# Altium schematic sheet 004-H-01.SchDoc
size A3
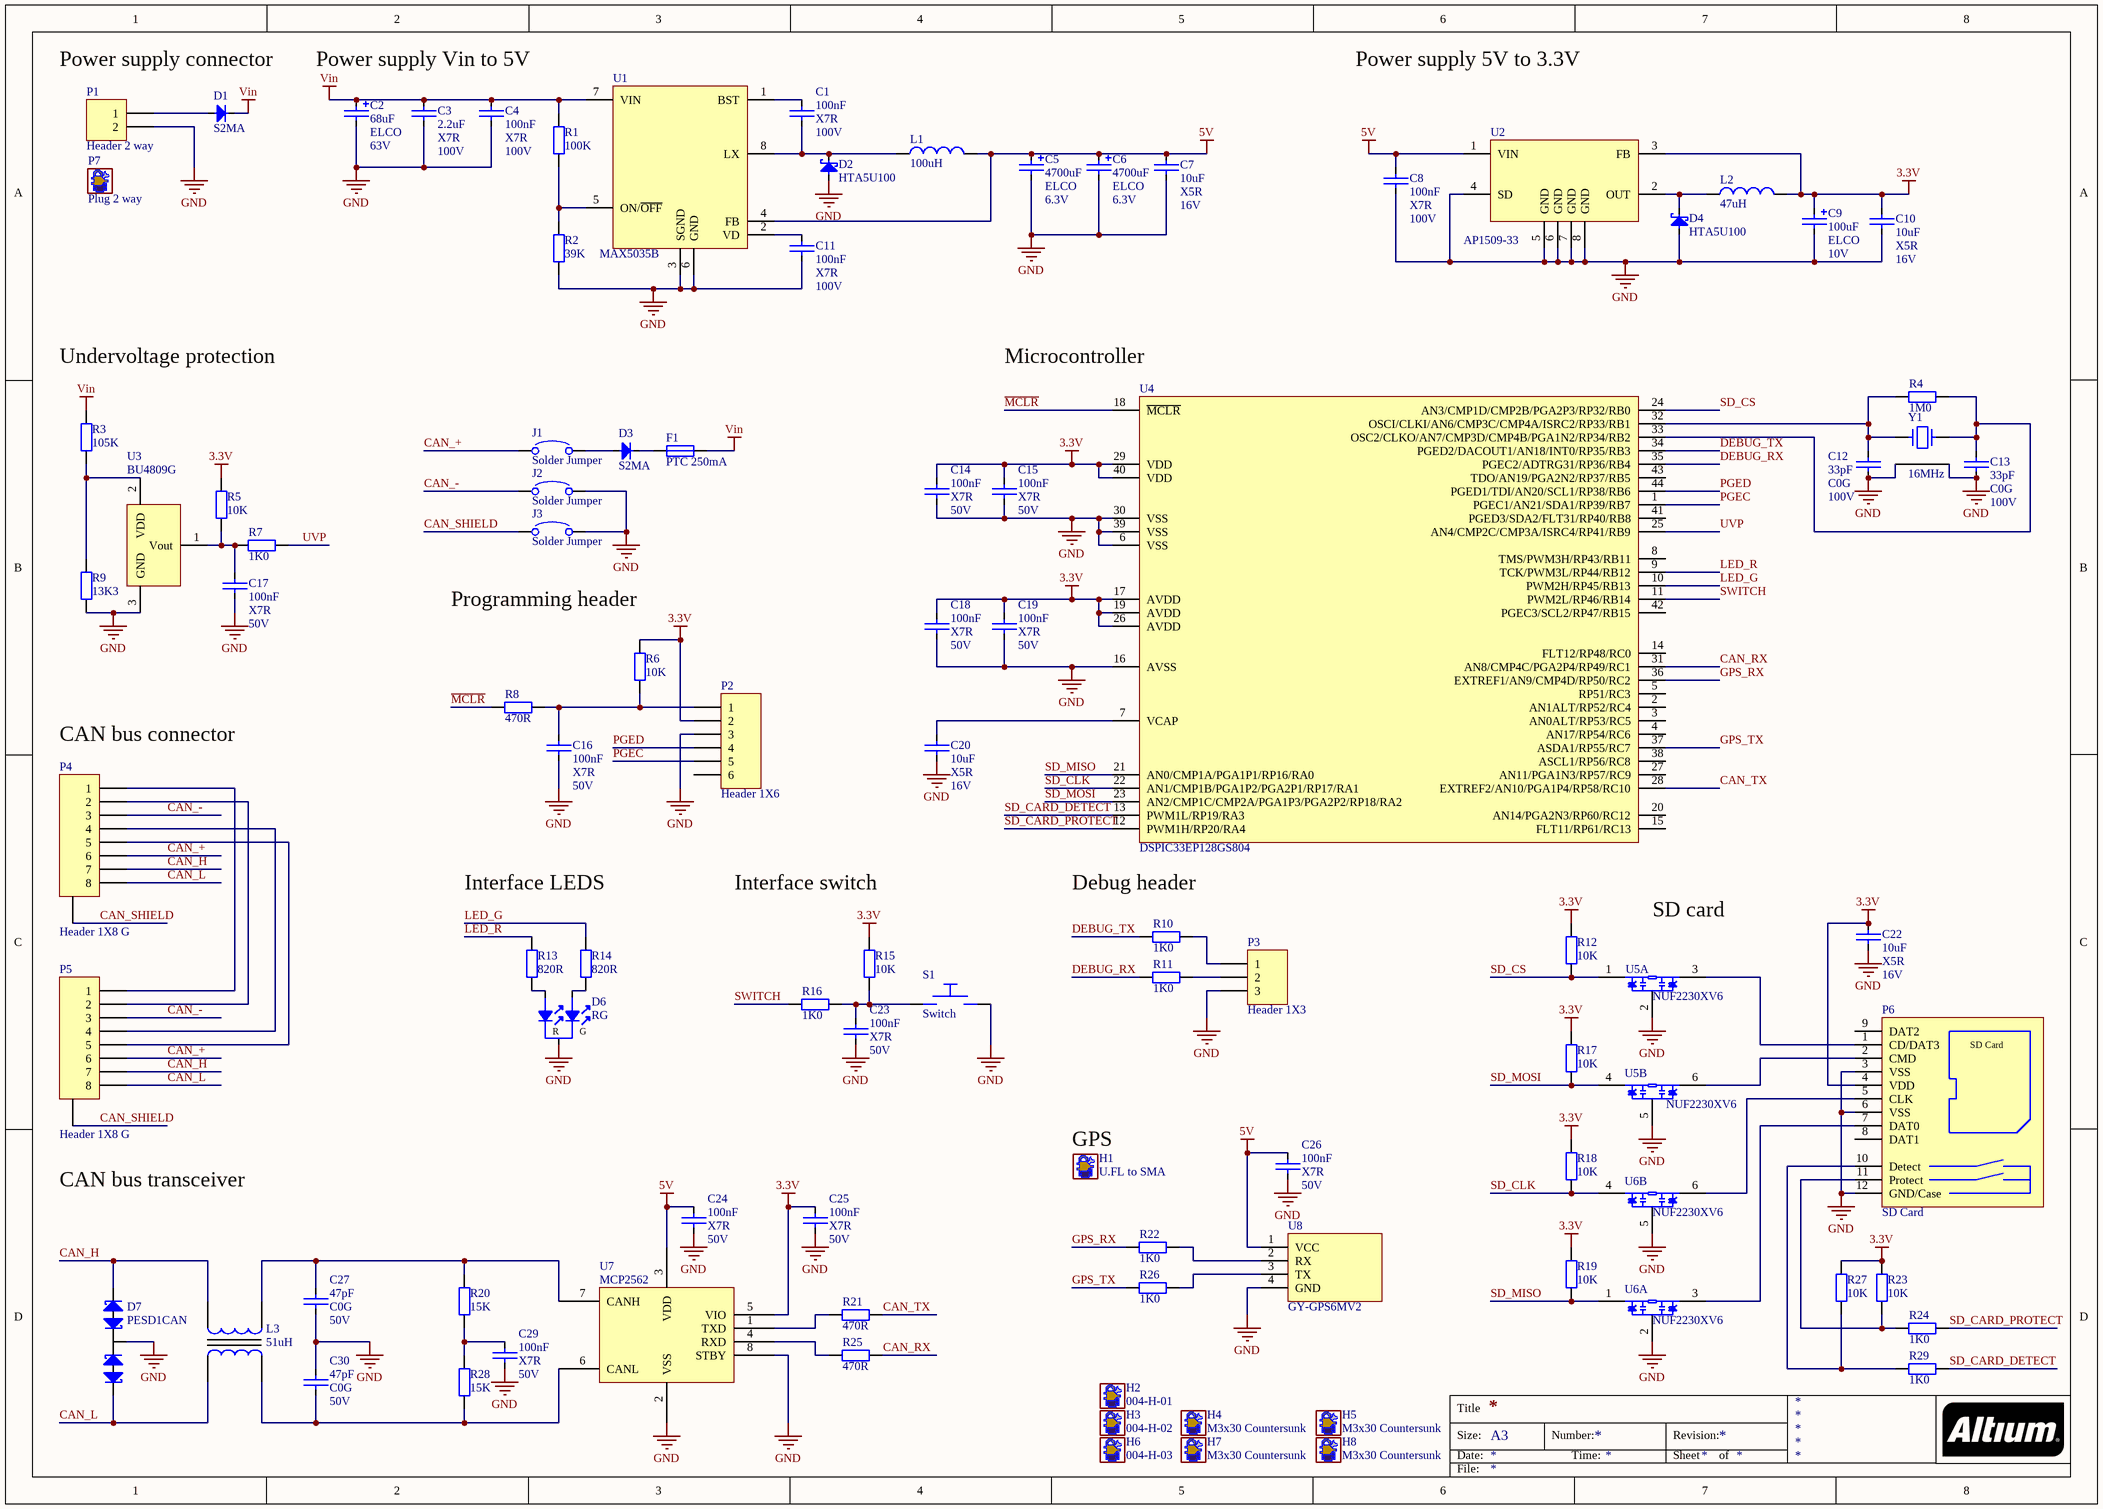
[diagram p0: 004-H-01.SchDoc]

## Parts
C1  100nF  Dielectric: X7R  VoltageRating: 100V  [CAP0805]
C2  68uF  Dielectric: ELCO  VoltageRating: 63V  [CAPP8383X62N]
C3  2.2uF  Dielectric: X7R  VoltageRating: 100V  [CAP1210]
C4  100nF  Dielectric: X7R  VoltageRating: 100V  [CAP0805]
C5  4700uF  Dielectric: ELCO  VoltageRating: 6.3V  [CAPPOL_leaded_D12_5L20P5]
C6  4700uF  Dielectric: ELCO  VoltageRating: 6.3V  [CAPPOL_leaded_D12_5L20P5]
C7  10uF  Dielectric: X5R  VoltageRating: 16V  [CAP1210]
C8  100nF  Dielectric: X7R  VoltageRating: 100V  [CAP0805]
C9  100uF  Dielectric: ELCO  VoltageRating: 10V  [CAPP8383X62N]
C10  10uF  Dielectric: X5R  VoltageRating: 16V  [CAP1210]
C11  100nF  Dielectric: X7R  VoltageRating: 100V  [CAP0805]
C12  33pF  Dielectric: C0G  VoltageRating: 100V  [CAP0603]
C13  33pF  Dielectric: C0G  VoltageRating: 100V  [CAP0603]
C14  100nF  Dielectric: X7R  VoltageRating: 50V  [CAP0603]
C15  100nF  Dielectric: X7R  VoltageRating: 50V  [CAP0603]
C16  100nF  Dielectric: X7R  VoltageRating: 50V  [CAP0603]
C17  100nF  Dielectric: X7R  VoltageRating: 50V  [CAP0603]
C18  100nF  Dielectric: X7R  VoltageRating: 50V  [CAP0603]
C19  100nF  Dielectric: X7R  VoltageRating: 50V  [CAP0603]
C20  10uF  Dielectric: X5R  VoltageRating: 16V  [CAP1210]
C22  10uF  Dielectric: X5R  VoltageRating: 16V  [CAP1210]
C23  100nF  Dielectric: X7R  VoltageRating: 50V  [CAP0603]
C24  100nF  Dielectric: X7R  VoltageRating: 50V  [CAP0603]
C25  100nF  Dielectric: X7R  VoltageRating: 50V  [CAP0603]
C26  100nF  Dielectric: X7R  VoltageRating: 50V  [CAP0603]
C27  47pF  Dielectric: C0G  VoltageRating: 50V  [CAP0603]
C29  100nF  Dielectric: X7R  VoltageRating: 50V  [CAP0603]
C30  47pF  Dielectric: C0G  VoltageRating: 50V  [CAP0603]
D1  S2MA  [DIODEDO-214AC]
D2  HTA5U100  [DIODEDO-214AC]
D3  S2MA  [DIODEDO-214AC]
D4  HTA5U100  [DIODEDO-214AC]
D6  RG  [LED_RG_COMMON_GND]
D7  PESD1CAN  [SOT23-3N]
F1  PTC 250mA  [Fuse1210]
H1  U.FL to SMA
H2  004-H-01
H3  004-H-02
H4  M3x30 Countersunk
H5  M3x30 Countersunk
H6  004-H-03
H7  M3x30 Countersunk
H8  M3x30 Countersunk
J1  Solder Jumper  [SolderJumer]  (no BOM)
J2  Solder Jumper  [SolderJumer]  (no BOM)
J3  Solder Jumper  [SolderJumer]  (no BOM)
L1  100uH  [INDP3030X28N]
L2  47uH  [INDP3030X28N]
L3  51uH  [IND200P450X300-4N]
P1  Header 2 way  [21.95MH/2-E]
P2  Header 1X6  [Header1X6P100]
P3  Header 1X3  [Header1X3P100]
P4  Header 1X8 G  [TECO-1-406541-5]
P5  Header 1X8 G  [TECO-1-406541-5]
P6  SD Card  [SDK-9BNS-K13-GS-TB]
P7  Plug 2 way
R1  100K  [RES0805]
R2  39K  [RES0805]
R3  105K  [RES0805]
R4  1M0  [RES0603]
R5  10K  [RES0603]
R6  10K  [RES0603]
R7  1K0  [RES0603]
R8  470R  [RES0603]
R9  13K3  [RES0805]
R10  1K0  [RES0603]
R11  1K0  [RES0603]
R12  10K  [RES0603]
R13  820R  [RES0603]
R14  820R  [RES0603]
R15  10K  [RES0603]
R16  1K0  [RES0603]
R17  10K  [RES0603]
R18  10K  [RES0603]
R19  10K  [RES0603]
R20  15K  [RES0603]
R21  470R  [RES0603]
R22  1K0  [RES0603]
R23  10K  [RES0603]
R24  1K0  [RES0603]
R25  470R  [RES0603]
R26  1K0  [RES0603]
R27  10K  [RES0603]
R28  15K  [RES0603]
R29  1K0  [RES0603]
S1  Switch  [FSMRA4JH]
U1  MAX5035B  [SOIC-8N]
U2  AP1509-33  [SOIC-8N]
U3  BU4809G  [SOT95P280X125-5N]
U4  DSPIC33EP128GS804  [TQFP80P1200X1200X120-44N]
U5  NUF2230XV6  [SOT50P160X60-6N]  (parts A,B of 2)
U6  NUF2230XV6  [SOT50P160X60-6N]  (parts A,B of 2)
U7  MCP2562  [SOIC-8N]
U8  GY-GPS6MV2  [GY-GPS6MV2]
Y1  16MHz  [CrystalSMD 5032]

## Nets
3.3V: C9.1 C10.2 C14.2 C15.2 C18.2 C19.2 C22.2 C25.2 L2.2 P2.2 P6.4(VDD) R5.1 R6.1 R12.1 R15.1 R17.1 R18.1 R19.1 R23.1 R27.1 U2.3(FB) U4.17(AVDD) U4.19(AVDD) U4.26(AVDD) U4.29(VDD) U4.40(VDD) U7.5(VIO)
5V: C5.1 C6.1 C7.2 C8.2 C24.2 C26.2 L1.2 U1.4(FB) U2.1(VIN) U7.3(VDD) U8.1(VCC)
GND: C2.2 C3.1 C4.1 C5.2 C6.2 C7.1 C8.1 C9.2 C10.1 C11.1 C12.1 C13.1 C14.1 C15.1 C16.2 C17.2 C18.1 C19.1 C20.1 C22.1 C23.1 C24.1 C25.1 C26.1 C27.1 C29.1 C30.2 D2.2(A) D4.2(A) D6.2(K) D7.3 J2.2 J3.2 P1.2 P2.3 P3.3 P6.3(VSS) P6.6(VSS) P6.12(GND/Case) R2.2 R9.2 S1.2 U1.3(SGND) U1.6(GND) U2.4(SD) U2.5(GND) U2.6(GND) U2.7(GND) U2.8(GND) U3.3(GND) U4.6(VSS) U4.16(AVSS) U4.30(VSS) U4.39(VSS) U5.2 U5.5 U6.2 U6.5 U7.2(VSS) U7.8(STBY) U8.4(GND) Y1.2 Y1.4
Vin: C2.1 C3.2 C4.2 D1.1(K) F1.2 R1.1 R3.1 U1.7(VIN)
CAN_+: J1.1 P4.6 P5.6
CAN_-: J2.1 P4.3 P5.3
CAN_H: D7.1 L3.4 P4.7 P5.7
CAN_L: D7.2 L3.1 P4.8 P5.8
CAN_RX: R25.2 U4.31(AN8/CMP4C/PGA2P4/RP49/RC1)
CAN_SHIELD: J3.1 P4.9(G) P5.9(G)
CAN_TX: R21.2 U4.28(EXTREF2/AN10/PGA1P4/RP58/RC10)
DEBUG_RX: R11.1 U4.35(PGEC2/ADTRG31/RP36/RB4)
DEBUG_TX: R10.1 U4.34(PGED2/DACOUT1/AN18/INT0/RP35/RB3)
GPS_RX: R22.1 U4.36(EXTREF1/AN9/CMP4D/RP50/RC2)
GPS_TX: R26.1 U4.37(ASDA1/RP55/RC7)
LED_G: R14.1 U4.10(PWM2H/RP45/RB13)
LED_R: R13.1 U4.9(TCK/PWM3L/RP44/RB12)
~{MCLR}: R8.1 U4.18(~{MCLR})
PGEC: P2.5 U4.1(PGEC1/AN21/SDA1/RP39/RB7)
PGED: P2.4 U4.44(PGED1/TDI/AN20/SCL1/RP38/RB6)
SD_CARD_DETECT: R29.2 U4.13(PWM1L/RP19/RA3)
SD_CARD_PROTECT: R24.2 U4.12(PWM1H/RP20/RA4)
SD_CLK: R18.2 U4.22(AN1/CMP1B/PGA1P2/PGA2P1/RP17/RA1) U6.4
SD_CS: R12.2 U4.24(AN3/CMP1D/CMP2B/PGA2P3/RP32/RB0) U5.1
SD_MISO: R19.2 U4.21(AN0/CMP1A/PGA1P1/RP16/RA0) U6.1
SD_MOSI: R17.2 U4.23(AN2/CMP1C/CMP2A/PGA1P3/PGA2P2/RP18/RA2) U5.4
SWITCH: R16.1 U4.11(PWM2L/RP46/RB14)
UVP: R7.2 U4.25(AN4/CMP2C/CMP3A/ISRC4/RP41/RB9)
NetC1_1: C1.1 D2.1(K) L1.1 U1.8(LX)
NetC1_2: C1.2 U1.1(BST)
NetC11_2: C11.2 U1.2(VD)
NetC12_2: C12.2 R4.1 U4.32(OSCI/CLKI/AN6/CMP3C/CMP4A/ISRC2/RP33/RB1) Y1.1
NetC13_2: C13.2 R4.2 U4.33(OSC2/CLKO/AN7/CMP3D/CMP4B/PGA1N2/RP34/RB2) Y1.3
NetC16_1: C16.1 P2.1 R6.2 R8.2
NetC17_1: C17.1 R5.2 R7.1 U3.1(Vout)
NetC20_2: C20.2 U4.7(VCAP)
NetC23_2: C23.2 R15.2 R16.2 S1.1
NetC27_2: C27.2 L3.3 R20.1 U7.7(CANH)
NetC29_2: C29.2 R20.2 R28.1
NetC30_1: C30.1 L3.2 R28.2 U7.6(CANL)
NetD1_2: D1.2(A) P1.1
NetD3_1: D3.1(K) F1.1
NetD3_2: D3.2(A) J1.2
NetD4_1: D4.1(K) L2.1 U2.2(OUT)
NetD6_1: D6.1(A_R) R13.2
NetD6_3: D6.3(A_G) R14.2
NetP3_1: P3.1 R10.2
NetP3_2: P3.2 R11.2
NetP4_1: P4.1 P5.1
NetP4_2: P4.2 P5.2
NetP4_4: P4.4 P5.4
NetP4_5: P4.5 P5.5
NetP6_1: P6.1(CD/DAT3) U5.3
NetP6_2: P6.2(CMD) U5.6
NetP6_5: P6.5(CLK) U6.6
NetP6_7: P6.7(DAT0) U6.3
NetP6_10: P6.10(Detect) R27.2 R29.1
NetP6_11: P6.11(Protect) R23.2 R24.1
NetR1_2: R1.2 R2.1 U1.5(ON/~{OFF})
NetR3_2: R3.2 R9.1 U3.2(VDD)
NetR21_1: R21.1 U7.1(TXD)
NetR22_2: R22.2 U8.2(RX)
NetR25_1: R25.1 U7.4(RXD)
NetR26_2: R26.2 U8.3(TX)

Not connected (* = marked no-connect by the designer): P2 6; P6 8(DAT1) 9(DAT2); U4 2(AN1ALT/RP52/RC4) 3(AN0ALT/RP53/RC5) 4(AN17/RP54/RC6) 5(RP51/RC3) 8(TMS/PWM3H/RP43/RB11) 14(FLT12/RP48/RC0) 15(FLT11/RP61/RC13) 20(AN14/PGA2N3/RP60/RC12) 27(AN11/PGA1N3/RP57/RC9) 38(ASCL1/RP56/RC8) 41(PGED3/SDA2/FLT31/RP40/RB8) 42(PGEC3/SCL2/RP47/RB15) 43(TDO/AN19/PGA2N2/RP37/RB5)

## Notes on the sheet
- Power supply connector
- Power supply Vin to 5V
- Power supply 5V to 3.3V
- Undervoltage protection
- (near U4) Microcontroller
- Programming header
- (near P4) CAN bus connector
- Interface LEDS
- Interface switch
- Debug header
- SD card
- CAN bus transceiver
- (near H1) GPS
- Title
- Size:
- Date:
- A3
- Number:
- Time:
- Revision:
- Sheet
- of
- File:
- (in symbol Led_RG_Common_GND) R; G

## Library data of the parts
C1 C4 C8 C11-C19 C23-C27 C29 C30 = Capacitor: Manufacturer: -; Manufacturer Part No: -; Farnell Ordercode: -; Price: 0.00
C2 = CapacitorPol: Capacitor Pol; Manufacturer: Panasonic; Manufacturer Part No: EEEFK1J680UP; Farnell Ordercode: 1850126; Price: 0.70
C3 = Capacitor: Manufacturer: AVX; Manufacturer Part No: C1210X225K1RACTU; Farnell Ordercode: 2820988; Price: 0.98
C5 C6 = CapacitorPol: Capacitor Pol; Manufacturer: Panasonic; Manufacturer Part No: ECA0JM472; Farnell Ordercode: 1848486; Price: 0.73
C7 C10 C20 C22 = Capacitor: Manufacturer: Multicomp; Manufacturer Part No: MC1210X106K160CT; Farnell Ordercode: 1759465; Price: 0.50
C9 = CapacitorPol: Capacitor Pol; Manufacturer: Panasonic; Manufacturer Part No: EEEHA1A101P; Farnell Ordercode: 1973295; Price: 0.11
D1 D3 = Diode: Manufacturer: Multicomp; Manufacturer Part No: S2MA; Farnell Ordercode: 2675071; Price: 0.13
D2 D4 = Diode Schottky: Manufacturer: Multicomp; Manufacturer Part No: HTA5U100; Farnell Ordercode: 2750942; Price: 0.46
D6 = Led_RG_Common_GND: Led RG; Manufacturer: Multicomp; Manufacturer Part No: MCL039PURGW; Farnell Ordercode: 1581194; Price: 0.21
D7 = PESD1CAN: ESD Protection Device, TVS, 70 V, SOT-23, 3 Pins; Manufacturer: NXP; Manufacturer Part No: PESD1CAN; Farnell Ordercode: 1510703; Price: 0.13
F1 = Fuse: Manufacturer: Bel Fuse; Manufacturer Part No: 0ZCH0010FF2E; Farnell Ordercode: 2834897; Price: 0.15
H1 = Hardware: RF / Coaxial Cable Assembly, U.FL Jack to SMA Bulkhead Jack, 50 ohm, 0.25 ft, 75 mm; Manufacturer: RF SOLUTIONS; Manufacturer Part No: CBA-UFLSMA-1; Farnell Ordercode: 2448785; Price: 0.00
H2 = Hardware: PCB; Manufacturer: -; Manufacturer Part No: -; Farnell Ordercode: -; Price: 0.00
H3 = Hardware: Casing bottom; Manufacturer: -; Manufacturer Part No: -; Farnell Ordercode: -; Price: 0.00
H4 H5 H7 H8 = Hardware: M3x30 Xountersunk Bolt; Manufacturer: -; Manufacturer Part No: -; Farnell Ordercode: -; Price: 0.00
H6 = Hardware: Casing top; Manufacturer: -; Manufacturer Part No: -; Farnell Ordercode: -; Price: 0.00
J1-J3 = SolderJumper: Solder jumper open; Manufacturer: -; Manufacturer Part No: -; Farnell Ordercode: -; Price: 0.00
L1 = Inductor: Manufacturer: BOURNS; Manufacturer Part No: SDR0302-101KL; Farnell Ordercode: 2212477; Price: 0.408
L2 = Inductor: Manufacturer: Bourns; Manufacturer Part No: SDR0302-470KL; Farnell Ordercode: 2328694; Price: 0.403
L3 = Choke Common Mode: Manufacturer: Bourns; Manufacturer Part No: SRF4532-510Y; Farnell Ordercode: 2859108; Price: 0.47
P1 = Header1X2: Manufacturer: IMO PRECISION CONTROLS; Manufacturer Part No: 21.95MH/2-E; Farnell Ordercode: 2517885; Price: 0.15
P2 = Header1X6: Connector 1X6; Manufacturer: Multicomp; Manufacturer Part No: 2211S-06G; Farnell Ordercode: 1593415; Price: 0.04
P3 = Header1X3: Connector 1X3; Manufacturer: Multicomp; Manufacturer Part No: 2211S-03G; Farnell Ordercode: 1593412; Price: 0.02
P4 P5 = Header1X8+G: Connector 1X8 with Ground; Manufacturer: TE CONNECTIVITY; Manufacturer Part No: 1-406541-5; Farnell Ordercode: -; Price: 0.00
P6 = SD slot: SD slot connector with card detect and protect; Manufacturer: JST; Manufacturer Part No: SDK-9BNS-K13-GS-TB; Farnell Ordercode: 2469853; Price: 1.46
P7 = Hardware: Generaric hardware; Manufacturer: IMO PRECISION CONTROLS; Manufacturer Part No: 21.950M/2-E; Farnell Ordercode: 2575233; Price: 0.37
R1-R29 = Resistor: Tolerance: 1%; Manufacturer: -; Manufacturer Part No: -; Farnell Ordercode: -; Price: 0.00
S1 = TactileSwitch: Tactile Switch; Manufacturer: TE CONNECTIVITY; Manufacturer Part No: FSMRA4JH; Farnell Ordercode: 1555988; Price: 0.14
U1 = MAX5035B: 5V 1A, 76V, High-Efficiency MAXPower Step-Down DC-DC Converter; Manufacturer: Maxim Integrated Products; Manufacturer Part No: MAX5035BUSA+T; Farnell Ordercode: 2799102; Price: 3.26
U2 = AP1509-33: 150KHz, 2A PWM BUCK DC/DC CONVERTER; Manufacturer: Diodes Inc; Manufacturer Part No: AP1509-33SG-13; Farnell Ordercode: 1825322; Price: 0.75
U3 = BD48xx: Voltage Detector; Manufacturer: ROHM; Manufacturer Part No: BU4809G-TR; Farnell Ordercode: 2342983; Price: 0.12
U4 = DSPIC33EP128GS804: 16-Bit Digital Signal Controllers fo  r Digital Power Applications with   Interconnected High-Speed PWM, ADC, PGA and Comparators; Manufacturer: Microchip; Manufacturer Part No: DSPIC33EP128GS804-I/PT; Farnell Ordercode: 2706170; Price: 4.44
U5 U6 = NUF2230XV6: 2 Line EMI Filter with ESDProtection; Manufacturer: ON SEMICONDUCTOR; Manufacturer Part No: NUF2230XV6T1G; Farnell Ordercode: 2774598; Price: 0.22
U7 = MCP2562: CAN Bus, Transceiver, CAN, LIN, 1, 1, 4.5 V, 5.5 V, SOIC; Manufacturer: Microchip; Manufacturer Part No: MCP2562-E/SN; Farnell Ordercode: 2362839; price: 0.79
U8 = GY-GPS6MV2: GPS module; Manufacturer: Ebay; Manufacturer Part No: GY-NEO6MV2; Farnell Ordercode: -; Price: 5.00
Y1 = Crystal_1: Crystal; Manufacturer: MULTICOMP; Manufacturer Part No: MCSJK-7I-16.00-18-30-60-B-30; Farnell Ordercode: 2854045; Price: 0.27